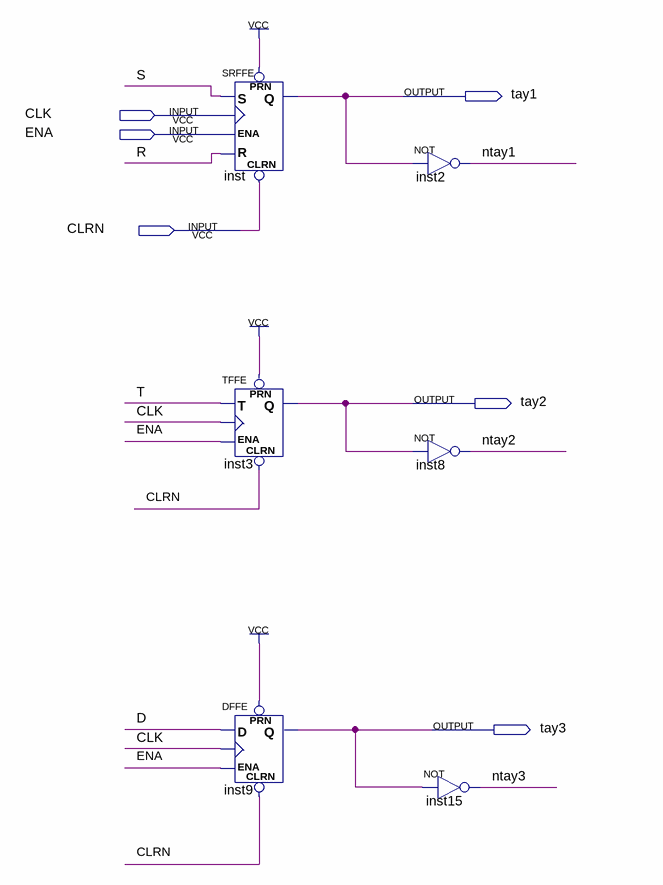
[diagram p0: schematic sheet]
// Quartus schematic mem.bdf as structural Verilog: 6 symbols, 6 pins
module mem (
  input  CLK,
  input  ENA,
  input  CLRN,
  output tay1,
  output tay2,
  output tay3
);

  wire D, ntay1, ntay2, ntay3, R, S, T;

  SRFFE inst (.PRN(1'b1), .S(S), .CLK(CLK), .CLRN(CLRN), .R(R), .ENA(ENA), .Q(tay1));
  TFFE inst3 (.CLRN(CLRN), .T(T), .CLK(CLK), .ENA(ENA), .PRN(1'b1), .Q(tay2));
  DFFE inst9 (.PRN(1'b1), .CLRN(CLRN), .D(D), .CLK(CLK), .ENA(ENA), .Q(tay3));
  not inst2 (ntay1, tay1);
  not inst8 (ntay2, tay2);
  not inst15 (ntay3, tay3);
endmodule
